# EasyEDA Pro project TTMT_ENTIRE_EASYEDA_PROJECT.epro, schematic panelschematic, sheets 2 to 3 of 3

## Sheets
2 P1_1: Create Date: 2026-05-14; Page Name: P1_1
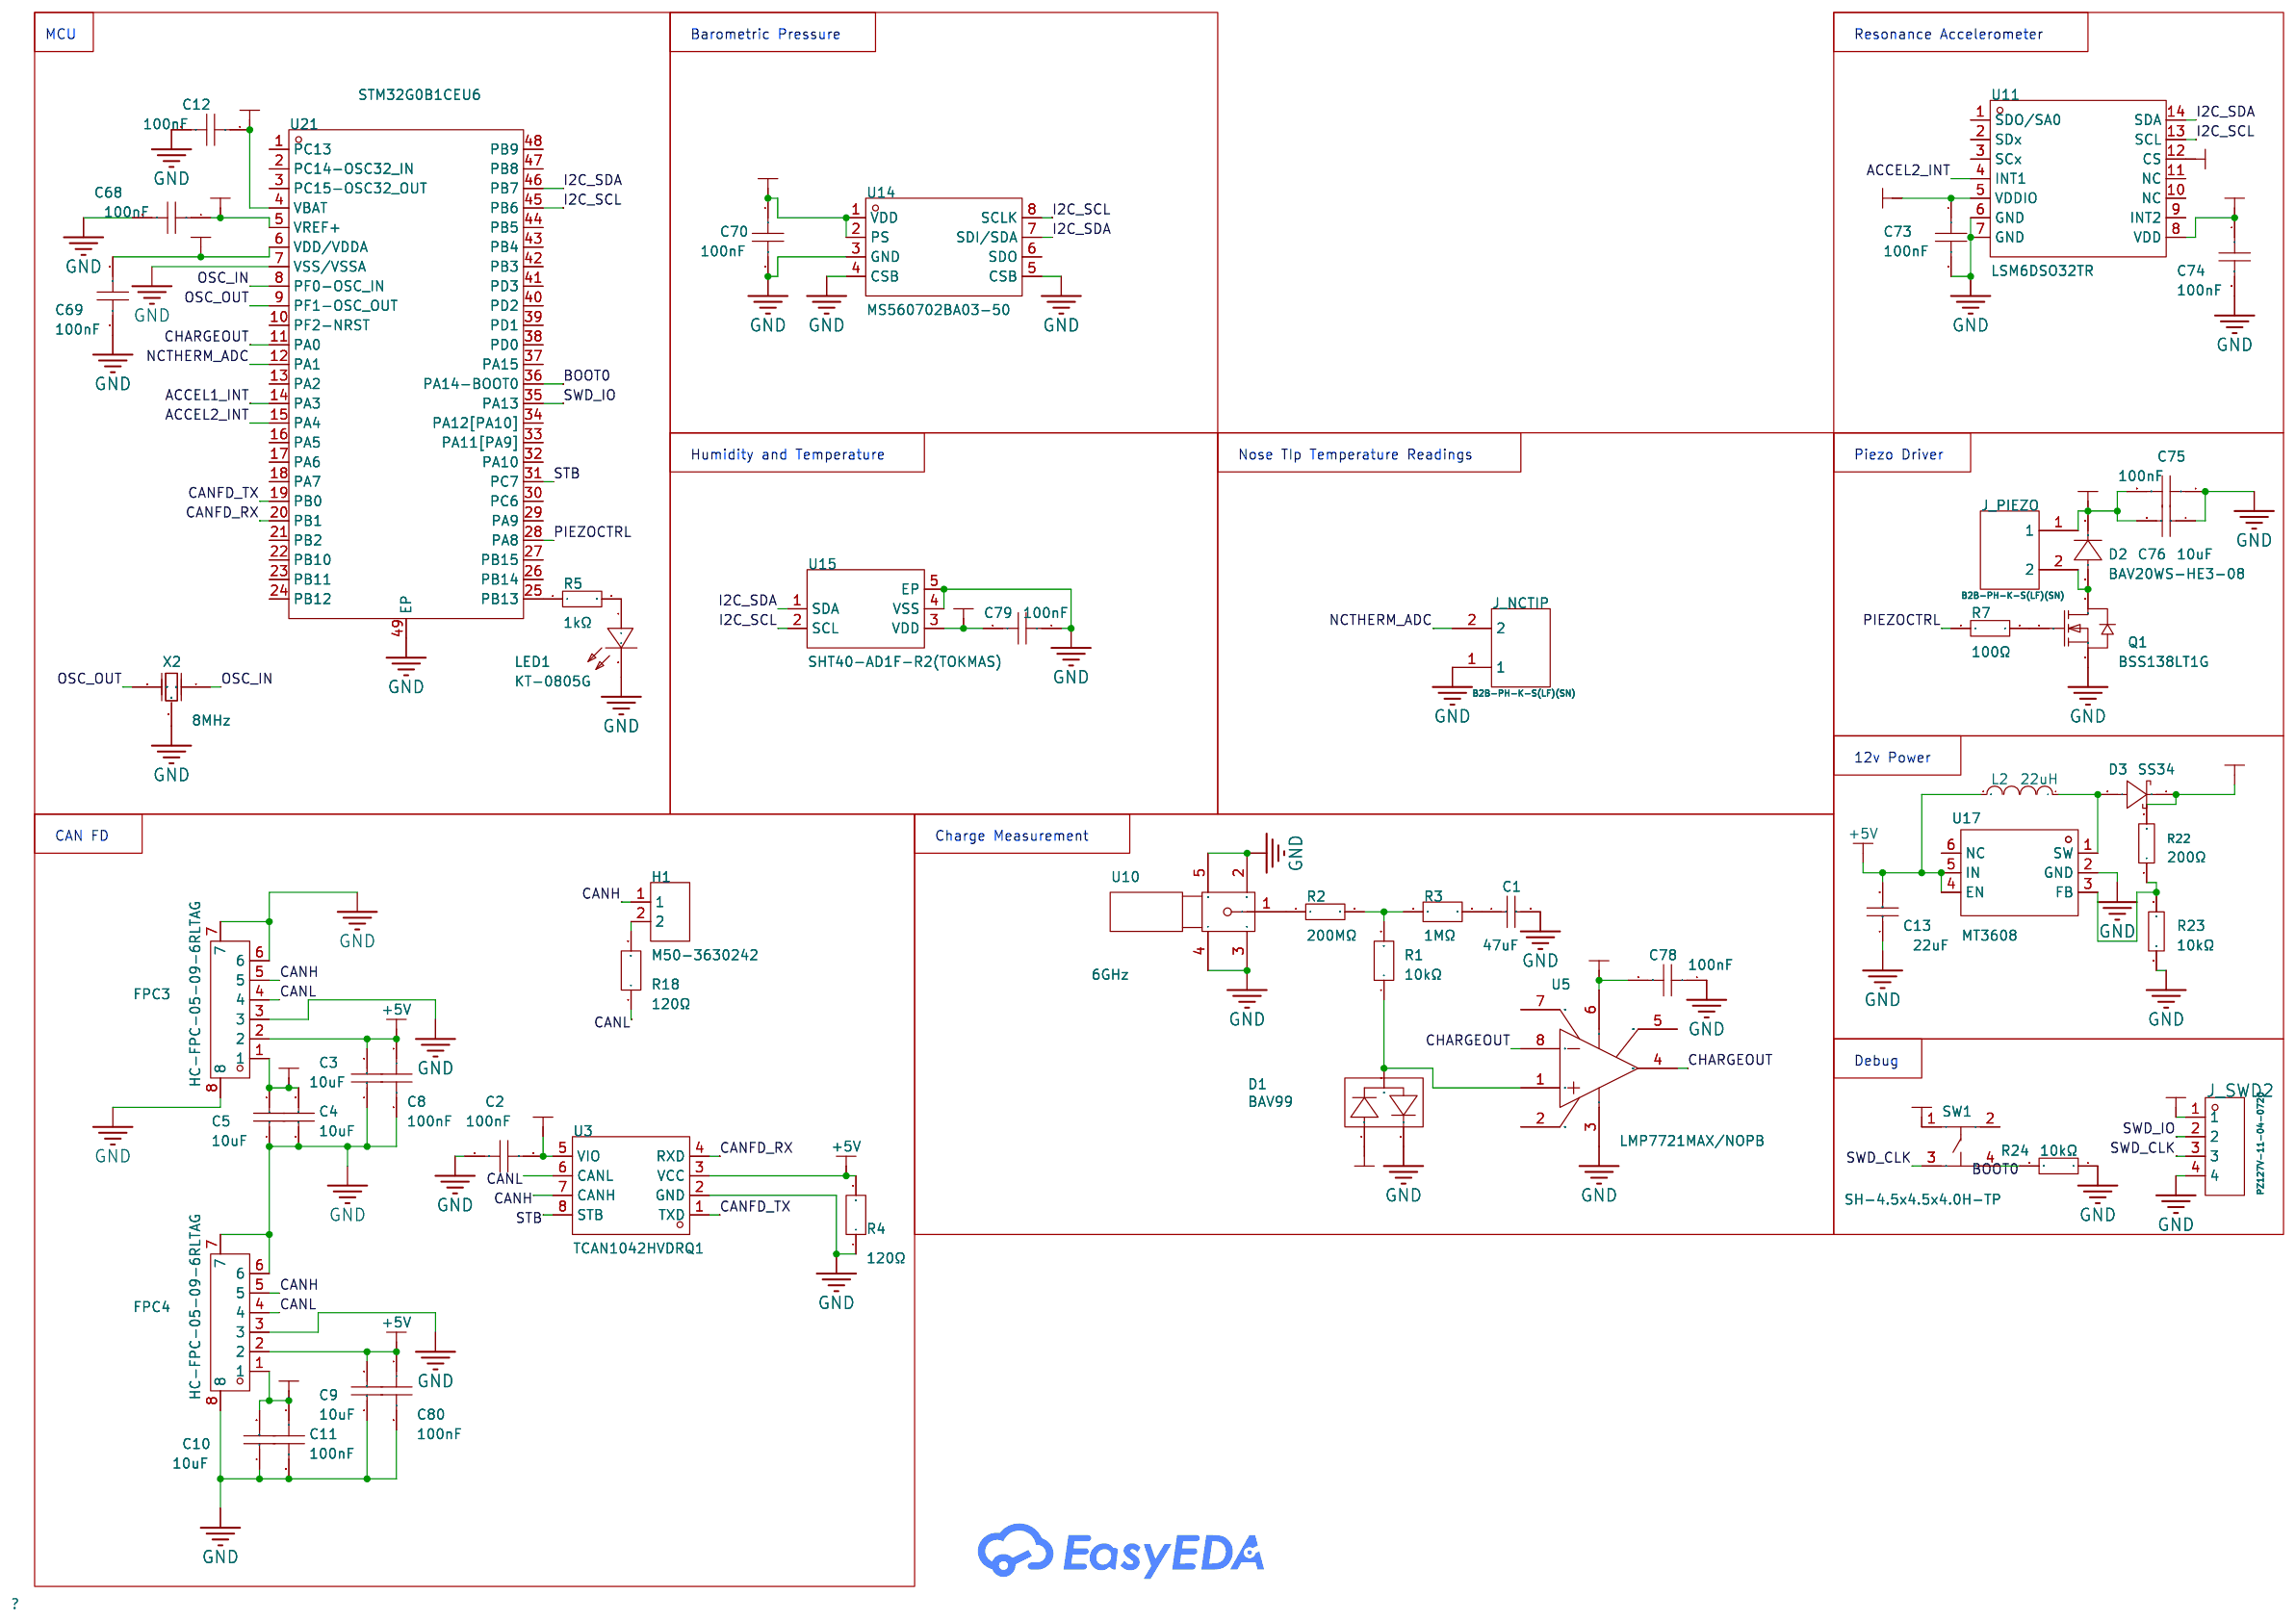
[diagram p6: P1_1]
3 P1_2: Create Date: 2026-05-14; Page Name: P1_2
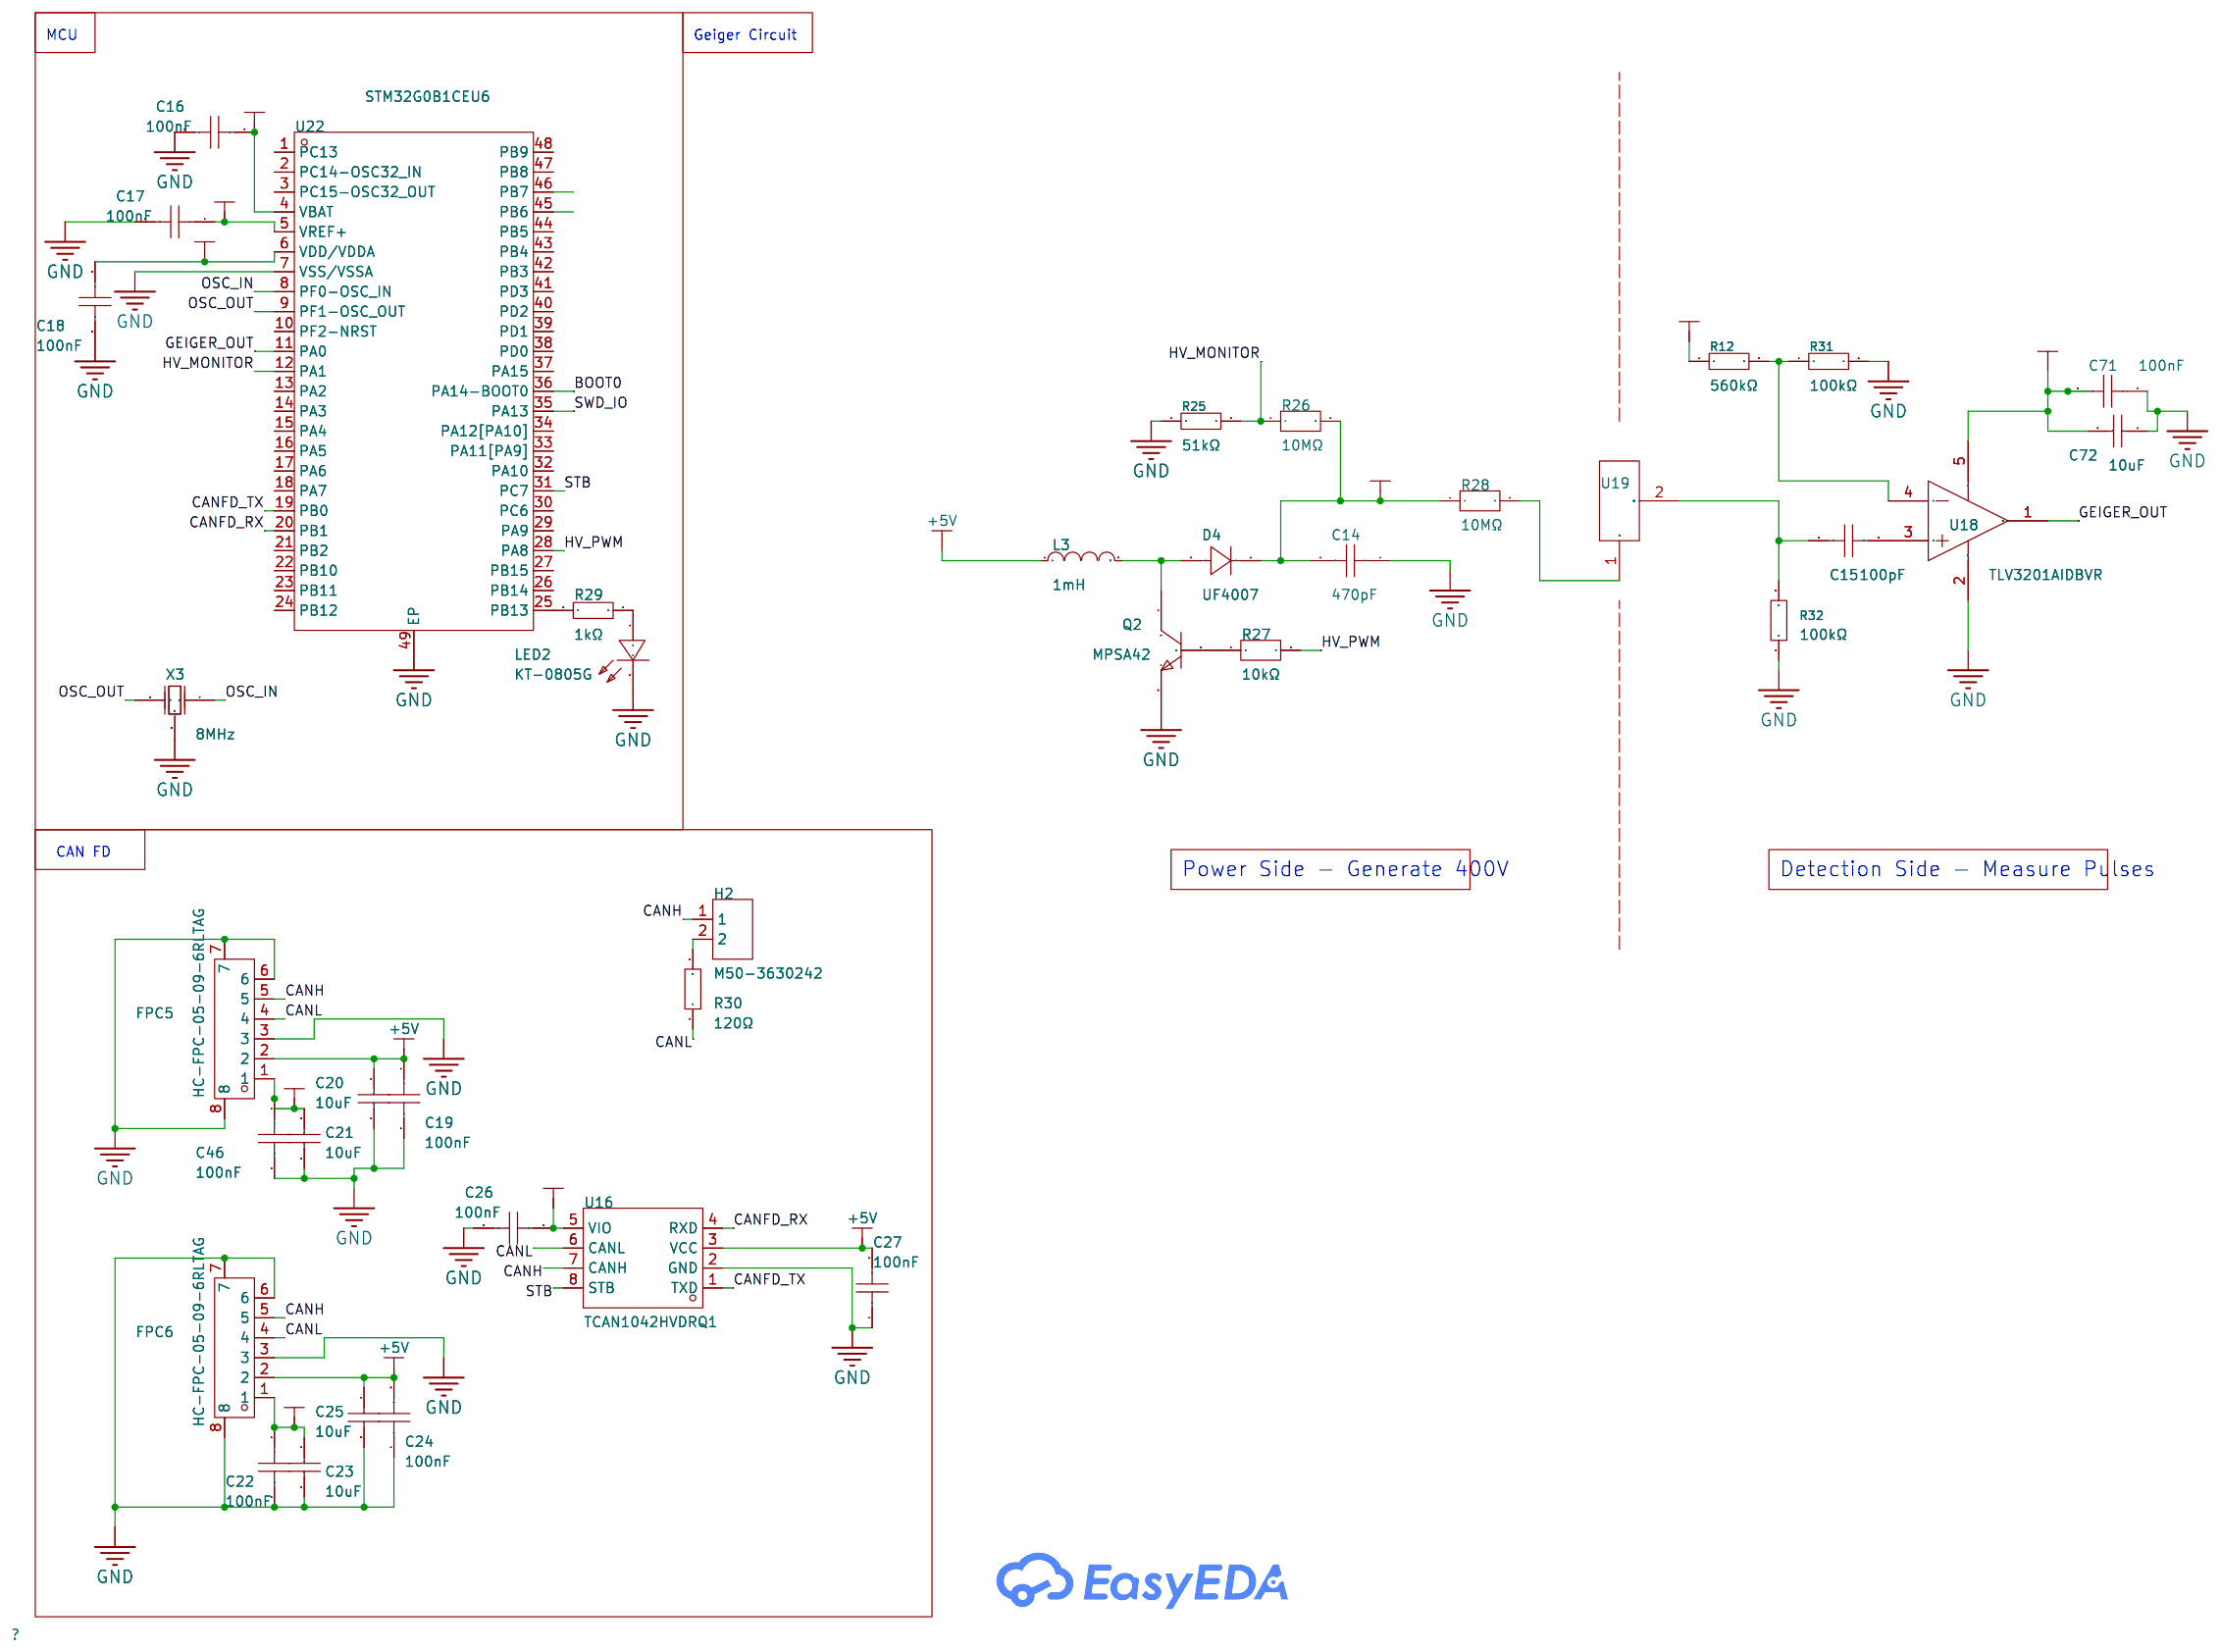
[diagram p7: P1_2]

## Parts
sheet P1_1
C1  47uF  [C0805]
C2  100nF  [C0402]
C3  10uF  [C0402]
C4  10uF  [C0402]
C5  10uF  [C0402]
C8  100nF  [C0402]
C9  10uF  [C0402]
C10  10uF  [C0402]
C11  100nF  [C0402]
C12  100nF  [C0402]
C13  22uF  [C1206]
C68  100nF  [C0402]
C69  100nF  [C0402]
C70  100nF  [C0402]
C73  100nF  [C0402]
C74  100nF  [C0402]
C75  100nF  [C0402]
C76  10uF  [C0402]
C78  100nF  [C0402]
C79  100nF  [C0402]
C80  100nF  [C0402]
D1  BAV99  [SOT-23-3_L2.9-W1.3-P1.90-LS2.4-BR]
D2  BAV20WS-HE3-08  [SOD-323_L1.8-W1.3-LS2.7-RD]
D3  SS34  [SMA_L4.2-W2.7-LS5.0-RD]
FPC3  HC-FPC-05-09-6RLTAG  [FPC-SMD_6P-P0.50_HC-FPC-05-09-6RLTAG]
FPC4  HC-FPC-05-09-6RLTAG  [FPC-SMD_6P-P0.50_HC-FPC-05-09-6RLTAG]
H1  M50-3630242  [HDR-SMD_2P-P1.27_M50-3630242]
J_NCTIP  B2B-PH-K-S(LF)(SN)  [CONN-TH_B2B-PH-K-S]
J_PIEZO  B2B-PH-K-S(LF)(SN)  [CONN-TH_B2B-PH-K-S]
J_SWD2  PZ127V-11-04-0720  [HDR-TH_4P-P1.27-V-M]
L2  22uH  [IND-SMD_L3.2-W2.5]
LED1  KT-0805G  [LED0805-R-RD]
Q1  BSS138LT1G  [SOT-23-3_L2.9-W1.6-P1.90-LS2.8-BR]
R1  10kΩ  [R0402]
R2  200MΩ  [RES-TH_L14.7-W2.54-P10.2-D0.8]
R3  1MΩ  [R0402]
R4  120Ω  [R0402]
R5  1kΩ  [R0402]
R7  100Ω  [R0402]
R18  120Ω  [R0402]
R22  200Ω  [R0603]
R23  10kΩ  [R0402]
R24  10kΩ  [R0402]
SW1  SH-4.5x4.5x4.0H-TP  [SW-SMD_4P-SH-4.5X4.5X4.0H-TP]
U3  TCAN1042HVDRQ1  [SOIC-8_L4.9-W3.9-P1.27-LS6.0-BL]
U5  LMP7721MAX/NOPB  [SOIC-8_L4.9-W3.9-P1.27-LS6.0-BL]
U10  6GHz  [MMCX-TH_DL-MMCX-KWE]
U11  LSM6DSO32TR  [LGA-14_L3.0-W2.5-P0.50-TL]
U14  MS560702BA03-50  [SENSOR-SMD_MS560702BA03-50]
U15  SHT40-AD1F-R2(TOKMAS)  [DFN-4_L1.5-W1.5-P0.80-TL-EP]
U17  MT3608  [SOT-23-6_L2.9-W1.6-P0.95-LS2.8-BL]
U21  STM32G0B1CEU6  [UFQFPN-48_L7.0-W7.0-P0.50-BL-EP]
X2  8MHz  [OSC-SMD_3P-L3.2-W1.3-P1.20-L]
sheet P1_2
C14  470pF  [C1111]
C15  100pF  [C1206]
C16  100nF  [C0402]
C17  100nF  [C0402]
C18  100nF  [C0402]
C19  100nF  [C0402]
C20  10uF  [C0402]
C21  10uF  [C0402]
C22  100nF  [C0402]
C23  10uF  [C0402]
C24  100nF  [C0402]
C25  10uF  [C0402]
C26  100nF  [C0402]
C27  100nF  [C0402]
C46  100nF  [C0402]
C71  100nF  [C0402]
C72  10uF  [C0402]
D4  UF4007  [DO-41_BD2.4-L4.7-P8.70-D0.9-RD]
FPC5  HC-FPC-05-09-6RLTAG  [FPC-SMD_6P-P0.50_HC-FPC-05-09-6RLTAG]
FPC6  HC-FPC-05-09-6RLTAG  [FPC-SMD_6P-P0.50_HC-FPC-05-09-6RLTAG]
H2  M50-3630242  [HDR-SMD_2P-P1.27_M50-3630242]
L3  1mH  [IND-SMD_L5.0-W5.0_FNR50XXS]
LED2  KT-0805G  [LED0805-R-RD]
Q2  MPSA42  [TO-92-3_L4.8-W3.7-P2.54-R]
R12  560kΩ  [R0402]
R25  51kΩ  [R0805]
R26  10MΩ  [R1206]
R27  10kΩ  [R0402]
R28  10MΩ  [R1206]
R29  1kΩ  [R0402]
R30  120Ω  [R0402]
R31  100kΩ  [R0402]
R32  100kΩ  [R0402]
U16  TCAN1042HVDRQ1  [SOIC-8_L4.9-W3.9-P1.27-LS6.0-BL]
U18  TLV3201AIDBVR  [SOT-23-5_L3.0-W1.7-P0.95-LS2.8-BR]
U19  SBM-21  [SBM21]  (no BOM)
U22  STM32G0B1CEU6  [UFQFPN-48_L7.0-W7.0-P0.50-BL-EP]
X3  8MHz  [OSC-SMD_3P-L3.2-W1.3-P1.20-L]

## Library data of the parts
C1 = CL21A476MQYNNNE: Capacitance:47uF Tolerance:±20% Tolerance:±20% Voltage Rating:6.3V Temperature Coefficient:X5R; LCSC Part Name: 47uF ±20% 6.3V; Supplier Part: C16780; Manufacturer: SAMSUNG(三星); Supplier Footprint: 0805; JLCPCB Part Class: Basic Part; Datasheet: https://item.szlcsc.com/datasheet/CL21A476MQYNNNE/17464.html; Supplier: LCSC; Tolerance: ±20%; Voltage Rating: 6.3V; Temperature Coefficient: X5R
C2 C8 C11 C12 C16-C19 C22 C24 C26 C27 C46 C68-C71 C73-C75 C78-C80 = CL05B104KO5NNNC: Capacitance:100nF Tolerance:±10% Tolerance:±10% Voltage Rating:16V Temperature Coefficient:X7R; LCSC Part Name: 100nF ±10% 16V; Supplier Part: C1525; Manufacturer: SAMSUNG(三星); Supplier Footprint: 0402; JLCPCB Part Class: Basic Part; Datasheet: https://item.szlcsc.com/datasheet/CL05B104KO5NNNC/1877.html; Supplier: LCSC; Tolerance: ±10%; Voltage Rating: 16V; Temperature Coefficient: X7R
C3-C5 C9 C10 C20 C21 C23 C25 C72 C76 = CL05A106MQ5NUNC: Capacitance:10uF Tolerance:±20% Tolerance:±20% Voltage Rating:6.3V Temperature Coefficient:X5R; LCSC Part Name: 10uF ±20% 6.3V; Supplier Part: C15525; Manufacturer: SAMSUNG(三星); Supplier Footprint: 0402; JLCPCB Part Class: Basic Part; Datasheet: https://item.szlcsc.com/datasheet/CL05A106MQ5NUNC/16204.html; Supplier: LCSC; Tolerance: ±20%; Voltage Rating: 6.3V; Temperature Coefficient: X5R
C13 = CL31A226KAHNNNE: Capacitance:22uF Tolerance:±10% Tolerance:±10% Voltage Rating:25V Temperature Coefficient:X5R; LCSC Part Name: 22uF ±10% 25V; Supplier Part: C12891; Manufacturer: SAMSUNG(三星); Supplier Footprint: 1206; JLCPCB Part Class: Basic Part; Datasheet: https://item.szlcsc.com/datasheet/CL31A226KAHNNNE/13537.html; Supplier: LCSC; Tolerance: ±10%; Voltage Rating: 25V; Temperature Coefficient: X5R
D1 = BAV99_C916421: Diode Configuration:1 Pair Series Connection Voltage - Forward(Vf@If):1.25V@150mA Voltage - DC Reverse(Vr):75V Current - Rectified:215mA Pd - Power Dissipation:350mW Reverse Leakage Current (Ir):1uA@75V Reverse Recovery Time (trr):4ns Operating Junction T; LCSC Part Name: 75V 215mA; Supplier Part: C916421; Manufacturer: JSMSEMI(杰盛微); Supplier Footprint: SOT-23; JLCPCB Part Class: Extended Part; Datasheet: https://item.szlcsc.com/datasheet/BAV99/990917.html; Supplier: LCSC; Diode Configuration: 1 Pair Series Connection; Voltage - Forward(Vf@If): 1.25V@150mA; Voltage - DC Reverse(Vr): 75V; Current - Rectified: 215mA; Pd - Power Dissipation: 350mW; Reverse Leakage Current (Ir): 1uA@75V; Reverse Recovery Time (trr): 4ns; Operating Junction Temperature Range: -65℃~+150℃; Non-Repetitive Peak Forward Surge Current: 2A
D2 = BAV20WS-HE3-08: Diode Configuration:1 Independent Pd - Power Dissipation:200mW Current - Rectified:250mA Voltage - DC Reverse(Vr):150V Voltage - Forward(Vf@If):1.25V@200mA Non-Repetitive Peak Forward Surge Current:1A Reverse Leakage Current (Ir):100nA@150V Reverse Recove; LCSC Part Name: 150V 250mA; Supplier Part: C3151637; Manufacturer: VISHAY(威世); Supplier Footprint: SOD-323; JLCPCB Part Class: Extended Part; Datasheet: https://item.szlcsc.com/datasheet/BAV20WS-HE3-08/3712173.html; Supplier: LCSC; Diode Configuration: 1 Independent; Pd - Power Dissipation: 200mW; Current - Rectified: 250mA; Voltage - DC Reverse(Vr): 150V; Voltage - Forward(Vf@If): 1.25V@200mA; Non-Repetitive Peak Forward Surge Current: 1A; Reverse Leakage Current (Ir): 100nA@150V; Reverse Recovery Time (trr): 50ns; Operating Junction Temperature Range: -55℃~+150℃
D3 = SS34_C2837271: Diode Configuration:- Voltage - Forward(Vf@If):550mV@3A Voltage - DC Reverse(Vr):40V Current - Rectified:3A Reverse Leakage Current (Ir):-; LCSC Part Name: 电压:40V 电流:3A; Supplier Part: C2837271; Manufacturer: JSMSEMI(杰盛微); Supplier Footprint: SMA(DO-214AC); JLCPCB Part Class: Extended Part; Datasheet: https://item.szlcsc.com/datasheet/SS34/3007843.html; Supplier: LCSC; Voltage - Forward(Vf@If): 550mV@3A; Voltage - DC Reverse(Vr): 40V; Current - Rectified: 3A
FPC3-FPC6 = HC-FPC-05-09-6RLTAG: Locking Feature:Hinged Lid Contact Type:Double-Sided Contacts, Top and Bottom Entry Number of Contacts:6P Pitch:0.5mm Mounting Type:Surface Mount, Right Angle FFC, FCB Thickness:0.3mm FFC, FCB Thickness:0.3mm Height Above Board:1mm Contact Material:Copper; LCSC Part Name: 翻盖式 双侧触点/上下接 P数:6P 间距:0.5mm; Supplier Part: C5213748; Manufacturer: HCTL(华灿天禄); Supplier Footprint: SMD,P=0.5mm,卧贴; JLCPCB Part Class: Extended Part; Datasheet: https://item.szlcsc.com/datasheet/HC-FPC-05-09-6RLTAG/5909040.html; Supplier: LCSC; Locking Feature: Hinged Lid; Contact Type: Double-Sided Contacts, Top and Bottom Entry; Number of Contacts: 6P; Pitch: 0.5mm; Mounting Type: Surface Mount, Right Angle; FFC, FCB Thickness: 0.3mm; Height Above Board: 1mm; Contact Material: Copper Alloy; Operating Temperature: -55℃~+85℃
H1 H2 = M50-3630242: Pitch:1.27mm Row Spacing:- Circluar Pins/Square Pins:Pin Header Mounting Type:Surface Mount,Vertical Number of Rows:1 Number of Pins:2P Current Rating:1A Length of Mating Pin:3mm Insulation Height:1mm Length of End Connection Pin:- Contact Material:Brass; LCSC Part Name: 间距:1.27mm 方针 立贴; Supplier Part: C7297891; Manufacturer: Harwin; Supplier Footprint: SMD,P=1.27mm; JLCPCB Part Class: Extended Part; Datasheet: https://item.szlcsc.com/datasheet/M50-3630242/8267898.html; Supplier: LCSC; Pitch: 1.27mm; Circluar Pins/Square Pins: Pin Header; Mounting Type: Surface Mount,Vertical; Number of Rows: 1; Number of Pins: 2P; Current Rating: 1A; Length of Mating Pin: 3mm; Insulation Height: 1mm; Contact Material: Brass; Contact Plating: Tin; Operating Temperature: -40℃~+105℃; Color: Black
J_NCTIP J_PIEZO = B2B-PH-K-S(LF)(SN): Pins Structure:1x2P Pitch:2mm Mounting Type:Through Hole Reference Series:PH Number of Pins:2P Number of Rows:1 Number of PINs Per Row:2 Row Spacing:- Current Rating:2A Contact Material:Brass Contact Plating:Tin Operating Temperature:-25℃~+85℃ Operating T; LCSC Part Name: 1x2P 间距:2mm 直插 系列:PH; Supplier Part: C131337; Manufacturer: JST; Supplier Footprint: 插件,P=2mm; JLCPCB Part Class: Extended Part; Datasheet: https://item.szlcsc.com/datasheet/B2B-PH-K-S(LF)(SN)/142630.html; Supplier: LCSC; Pins Structure: 1x2P; Pitch: 2mm; Mounting Type: Through Hole; Reference Series: PH; Number of Pins: 2P; Number of Rows: 1; Number of PINs Per Row: 2; Current Rating: 2A; Contact Material: Brass; Contact Plating: Tin; Operating Temperature: -25℃~+85℃; Voltage Rating: 100V; Plastic Material: PA66; Flame Retardant Rating: UL94V-0; Supplementary Features: K Pin; Color: White; Z-Height of the Board: 6mm; X-Length of Bottom Edge on Board (Spacing Line): 5.9mm; Y-Width of Bottom Edge on Board: 4.5mm
J_SWD2 = PZ127V-11-04-0720: Pin Structure:1x4P Pitch:1.27mm Row Spacing:- Circluar Pins/Square Pins:Pin Header Mounting Type:Through Hole Number of Rows:1 Number of Pins:4P Current Rating:1A Voltage Rating (Max):- Length of Mating Pin:3.9mm Insulation Height:1mm Length of End Connec; LCSC Part Name: 1x4P 间距:1.27mm 方针 直插; Supplier Part: C541879; Manufacturer: XFCN(兴飞); Supplier Footprint: 插件,P=1.27mm; JLCPCB Part Class: Extended Part; Datasheet: https://item.szlcsc.com/datasheet/PZ127V-11-04-0720/562500.html; Supplier: LCSC; Pin Structure: 1x4P; Pitch: 1.27mm; Circluar Pins/Square Pins: Pin Header; Mounting Type: Through Hole; Number of Rows: 1; Number of Pins: 4P; Current Rating: 1A; Length of Mating Pin: 3.9mm; Insulation Height: 1mm; Length of End Connection Pin: 2.3mm; Contact Material: Brass; Operating Temperature: -40℃~+105℃; Color: Black
L2 = NLV32T-220J-EF: Inductance: Tolerance:±5% Tolerance:±5% Rated Current: Saturation Current (Isat):- DC Resistance (DCR): Ratings:-; LCSC Part Name: 22uH ±5%; Supplier Part: C295143; Manufacturer: TDK; Supplier Footprint: 1210; JLCPCB Part Class: Extended Part; Datasheet: https://atta.szlcsc.com/upload/public/pdf/source/20190114/C295361_7F4084769062E2B02C18E7F2085EC2BC.pdf; Supplier: LCSC; Tolerance: ±5%
LED1 LED2 = KT-0805G: Lamp Holder Type:- Illumination Color:Emerald Green Voltage - Forward(Vf):2.6V~3.1V Voltage - Forward(Vf):2.6V~3.1V Power(Watts):100mW Forward Current:5mA Wavelength - Dominant:513nm~528nm Wavelength - Dominant:513nm~528nm Peak Wavelength:525nm Diode Conf; LCSC Part Name: 0805 翠绿 高亮; Supplier Part: C2297; Manufacturer: KENTO; Supplier Footprint: 0805; JLCPCB Part Class: Basic Part; Datasheet: https://item.szlcsc.com/datasheet/KT-0805G/2670.html; Supplier: LCSC; Illumination Color: Emerald Green; Voltage - Forward(Vf): 2.6V~3.1V; Power(Watts): 100mW; Forward Current: 5mA; Wavelength - Dominant: 513nm~528nm; Peak Wavelength: 525nm; Diode Configuration: Discrete Diode; Lens Color: Water Clear; Luminous Intensity: 430mcd; Viewing Angle: 120°; Operating Temperature: -40℃~+85℃
Q1 = BSS138LT1G: Number:1 N-Channel Drain to Source Voltage:50V Current - Continuous Drain(Id):200mA RDS(on):5.6Ω@2.75V Pd - Power Dissipation:225mW Gate Threshold Voltage (Vgs(th)):500mV Input Capacitance(Ciss):50pF@25V Reverse Transfer Capacitance (Crss@Vds):5pF@25V Ope; LCSC Part Name: 1个N沟道 耐压:50V 电流:200mA; Supplier Part: C82045; Manufacturer: onsemi(安森美); Supplier Footprint: SOT-23; JLCPCB Part Class: Extended Part; Datasheet: https://item.szlcsc.com/datasheet/BSS138LT1G/83200.html; Supplier: LCSC; Number: 1 N-Channel; Drain to Source Voltage: 50V; Current - Continuous Drain(Id): 200mA; RDS(on): 5.6Ω@2.75V; Pd - Power Dissipation: 225mW; Gate Threshold Voltage (Vgs(th)): 500mV; Input Capacitance(Ciss): 50pF@25V; Reverse Transfer Capacitance (Crss@Vds): 5pF@25V; Operating Temperature: -55℃~+150℃
R1 = FRC0402F1002TS: Type:Thick Film Resistor Resistance:10kΩ Tolerance:±1% Tolerance:±1% Power(Watts):62.5mW Voltage-Supply(Max):50V Temperature Coefficient:±100ppm/℃ Temperature Coefficient:±100ppm/℃ Operating Temperature:-55℃~+155℃ Operating Temperature:-55℃~+155℃; LCSC Part Name: 10kΩ ±1% 62.5mW 厚膜电阻; Supplier Part: C2906861; Manufacturer: FOJAN(富捷); Supplier Footprint: 0402; JLCPCB Part Class: Extended Part; Supplier: LCSC; Type: Thick Film Resistor; Tolerance: ±1%; Power(Watts): 62.5mW; Voltage-Supply(Max): 50V; Temperature Coefficient: ±100ppm/℃; Operating Temperature: -55℃~+155℃
R2 = SM102032006FE: Type:Thick Film Resistor Resistance: Tolerance:±1% Tolerance:±1% Power(Watts):1W Temperature Coefficient:±50ppm/℃ Temperature Coefficient:±50ppm/℃ Operating Temperature:-55℃~+110℃ Operating Temperature:-55℃~+110℃; LCSC Part Name: 厚膜电阻 200MΩ ±1% 1W; Supplier Part: C2641611; Manufacturer: Ohmite; Supplier Footprint: 插件; JLCPCB Part Class: Extended Part; Datasheet: https://item.szlcsc.com/datasheet/SM102032006FE/2733517.html; Supplier: LCSC; Type: Thick Film Resistor; Tolerance: ±1%; Power(Watts): 1W; Temperature Coefficient: ±50ppm/℃; Operating Temperature: -55℃~+110℃
R3 = FRC0402F1004TS: Type:Thick Film Resistor Resistance:1MΩ Tolerance:±1% Tolerance:±1% Power(Watts):62.5mW Voltage-Supply(Max):50V Temperature Coefficient:±100ppm/℃ Temperature Coefficient:±100ppm/℃ Operating Temperature:-55℃~+155℃ Operating Temperature:-55℃~+155℃; LCSC Part Name: 1MΩ ±1% 62.5mW 厚膜电阻; Supplier Part: C2909328; Manufacturer: FOJAN(富捷); Supplier Footprint: 0402; JLCPCB Part Class: Extended Part; Supplier: LCSC; Type: Thick Film Resistor; Tolerance: ±1%; Power(Watts): 62.5mW; Voltage-Supply(Max): 50V; Temperature Coefficient: ±100ppm/℃; Operating Temperature: -55℃~+155℃
R4 R18 = FRC0402F1200TS: Type:Thick Film Resistor Resistance:120Ω Tolerance:±1% Tolerance:±1% Power(Watts):62.5mW Voltage-Supply(Max):50V Temperature Coefficient:±100ppm/℃ Temperature Coefficient:±100ppm/℃ Operating Temperature:-55℃~+155℃ Operating Temperature:-55℃~+155℃; LCSC Part Name: 120Ω ±1% 62.5mW 厚膜电阻; Supplier Part: C2909315; Manufacturer: FOJAN(富捷); Supplier Footprint: 0402; JLCPCB Part Class: Extended Part; Datasheet: https://item.szlcsc.com/datasheet/FRC0402F1200TS/3186250.html; Supplier: LCSC; Type: Thick Film Resistor; Tolerance: ±1%; Power(Watts): 62.5mW; Voltage-Supply(Max): 50V; Temperature Coefficient: ±100ppm/℃; Operating Temperature: -55℃~+155℃
R5 R29 = 0402WGF1001TCE: Type:Thick Film Resistor Resistance:1kΩ Tolerance:±1% Tolerance:±1% Power(Watts):62.5mW Voltage-Supply(Max):50V Temperature Coefficient:±100ppm/℃ Temperature Coefficient:±100ppm/℃ Operating Temperature:-55℃~+155℃ Operating Temperature:-55℃~+155℃; LCSC Part Name: 1kΩ ±1% 62.5mW 厚膜电阻; Supplier Part: C11702; Manufacturer: UNI-ROYAL(厚声); Supplier Footprint: 0402; JLCPCB Part Class: Basic Part; Datasheet: https://item.szlcsc.com/datasheet/0402WGF1001TCE/12256.html; Supplier: LCSC; Type: Thick Film Resistor; Tolerance: ±1%; Power(Watts): 62.5mW; Voltage-Supply(Max): 50V; Temperature Coefficient: ±100ppm/℃; Operating Temperature: -55℃~+155℃
R7 = 0402WGF1000TCE: Type:Thick Film Resistors Resistance: Tolerance:±1% Tolerance:±1% Power(Watts): Overload Voltage (Max): Temperature Coefficient:±200ppm/℃ Temperature Coefficient:±200ppm/℃ Operating Temperature Range:-55℃~+155℃ Operating Temperature Range:-55℃~+155℃; LCSC Part Name: 100Ω ±1% 62.5mW 厚膜电阻; Supplier Part: C25076; Manufacturer: UNI-ROYAL(厚声); Supplier Footprint: 0402; JLCPCB Part Class: Basic Part; Datasheet: https://atta.szlcsc.com/upload/public/pdf/source/20200306/C422600_1E6D84923E4A46A82E41ADD87F860B5C.pdf; Supplier: LCSC; Type: Thick Film Resistors; Tolerance: ±1%; Temperature Coefficient: ±200ppm/℃; Operating Temperature Range: -55℃~+155℃
R22 = 0603WAF2000T5E: Type:Thick Film Resistor Resistance:200Ω Tolerance:±1% Tolerance:±1% Power(Watts):100mW Voltage-Supply(Max):75V Temperature Coefficient:±100ppm/℃ Temperature Coefficient:±100ppm/℃ Operating Temperature:-55℃~+155℃ Operating Temperature:-55℃~+155℃; LCSC Part Name: 200Ω ±1% 100mW 厚膜电阻; Supplier Part: C8218; Manufacturer: UNI-ROYAL(厚声); Supplier Footprint: 0603; JLCPCB Part Class: Basic Part; Datasheet: https://item.szlcsc.com/datasheet/0603WAF2000T5E/8708.html; Supplier: LCSC; Type: Thick Film Resistor; Tolerance: ±1%; Power(Watts): 100mW; Voltage-Supply(Max): 75V; Temperature Coefficient: ±100ppm/℃; Operating Temperature: -55℃~+155℃
R23 R24 = 0402WGF1002TCE: Type:Thick Film Resistor Resistance:10kΩ Tolerance:±1% Tolerance:±1% Power(Watts):62.5mW Voltage-Supply(Max):50V Temperature Coefficient:±100ppm/℃ Temperature Coefficient:±100ppm/℃ Operating Temperature:-55℃~+155℃ Operating Temperature:-55℃~+155℃; LCSC Part Name: 10kΩ ±1% 62.5mW 厚膜电阻; Supplier Part: C25744; Manufacturer: UNI-ROYAL(厚声); Supplier Footprint: 0402; JLCPCB Part Class: Basic Part; Datasheet: https://item.szlcsc.com/datasheet/0402WGF1002TCE/26487.html; Supplier: LCSC; Type: Thick Film Resistor; Tolerance: ±1%; Power(Watts): 62.5mW; Voltage-Supply(Max): 50V; Temperature Coefficient: ±100ppm/℃; Operating Temperature: -55℃~+155℃
SW1 = SH-4.5x4.5x4.0H-TP: LCSC Part Name: TS4540TP 250gf编带; Supplier Part: C52092029; Manufacturer: SHOU HAN(首韩); Supplier Footprint: SMD; JLCPCB Part Class: Extended Part; Datasheet: https://item.szlcsc.com/datasheet/SH-4.5x4.5x4.0H-TP/54864053.html; Supplier: LCSC
U3 U16 = TCAN1042HVDRQ1: Type:CAN FD Transceiver Data Rate:2Mbps Voltage - Supply:4.5V~5.5V Voltage - Supply:4.5V~5.5V Current - Supply:80mA Operating Temperature:-55℃~+125℃ Operating Temperature:-55℃~+125℃ Number of Channels:- Quiescent Supply Current:22uA; LCSC Part Name: TCAN1042-Q1 汽车故障保护 CAN 收发器，带 CAN FD; Supplier Part: C485807; Manufacturer: TI(德州仪器); Supplier Footprint: SOIC-8; JLCPCB Part Class: Extended Part; Datasheet: https://www.ti.com/cn/lit/gpn/tcan1042hv-q1; Supplier: LCSC; Type: CAN FD Transceiver; Data Rate: 2Mbps; Voltage - Supply: 4.5V~5.5V; Current - Supply: 80mA; Operating Temperature: -55℃~+125℃; Quiescent Supply Current: 22uA
U5 = LMP7721MAX/NOPB: Number of Channels:1 Maximum Power Supply Range (Vdd-Vss):5.5V Rail to Rail:Rail-to-Rail Output Gain Bandwidth Product:17MHz Vos - Input Offset Voltage:26uV Input Offset Voltage Drift(Vos TC):1.5uV/℃ Slew Rate:12.76V/us Ib - Input Bias Current:0.003pA Inp; LCSC Part Name: 超低输入偏置电流精密放大器; Supplier Part: C2864387; Manufacturer: TI(德州仪器); Supplier Footprint: SOIC-8; JLCPCB Part Class: Extended Part; Datasheet: https://www.ti.com/cn/lit/gpn/lmp7721; Supplier: LCSC; Number of Channels: 1; Maximum Power Supply Range (Vdd-Vss): 5.5V; Rail to Rail: Rail-to-Rail Output; Gain Bandwidth Product: 17MHz; Vos - Input Offset Voltage: 26uV; Input Offset Voltage Drift(Vos TC): 1.5uV/℃; Slew Rate: 12.76V/us; Ib - Input Bias Current: 0.003pA; Input Offset Current(Ios): 0.006pA; Input Voltage Noise Density: 6.5nV/√Hz@1kHz; Common Mode Rejection Ratio(CMRR): 100dB; Quiescent Current: 1.3mA; Output Current: 46mA; Operating Temperature: -40℃~+125℃; Single supply: 1.8V~5.5V
U10 = BWMMCX-KWE: Connector Type:Board Side Interface:Inner Bore Number of Ports:1 Interface Diameter:3.45mm Interface Length/Height:6.8mm Frequency:6GHz RF Series:- Impedance:50Ω Style:Elbow Operating Temperature Range:- Operating Temperature Range:-; LCSC Part Name: 内孔 弯头; Supplier Part: C5137199; Manufacturer: BAT WIRELESS(蝙蝠无线); Supplier Footprint: 插件; JLCPCB Part Class: Extended Part; Datasheet: https://item.szlcsc.com/datasheet/BWMMCX-KWE/5745896.html; Supplier: LCSC; Connector Type: Board Side; Interface: Inner Bore; Number of Ports: 1; Interface Diameter: 3.45mm; Interface Length/Height: 6.8mm; Impedance: 50Ω; Style: Elbow
U11 = LSM6DSO32TR: Sensor Type:加速度计陀螺仪 Operating Temperature:-40℃~+85℃ Operating Temperature:-40℃~+85℃; Supplier Part: C1864162; Manufacturer: ST(意法半导体); Supplier Footprint: LGA-14(2.5x3); JLCPCB Part Class: Extended Part; Datasheet: https://atta.szlcsc.com/upload/public/pdf/source/20210701/34CD2F0BBC0E28C2A99EB6D9CC8DCB24.pdf; Supplier: LCSC; Sensor Type: 加速度计陀螺仪; Operating Temperature: -40℃~+85℃
U14 = MS560702BA03-50: Pressure range:1Kpa~1.2bar Pressure range:1Kpa~1.2bar Voltage - Supply:1.8V~3.6V Voltage - Supply:1.8V~3.6V Standby Current:140nA Interface:SPI；I2C Module:Yes Absolute Accuracy:1.5mbar Relative Accuracy:- Features:片内温度输出；集成ADC与数字接口；片内校准与非易失存储 Temperature; LCSC Part Name: MS5607-02BA03; Supplier Part: C97627; Manufacturer: TE Connectivity(泰科电子); Supplier Footprint: SMD-8P; JLCPCB Part Class: Extended Part; Datasheet: https://item.szlcsc.com/datasheet/MS560702BA03-50/98835.html; Supplier: LCSC; Pressure range: 1Kpa~1.2bar; Voltage - Supply: 1.8V~3.6V; Standby Current: 140nA; Interface: SPI；I2C; Module: Yes; Absolute Accuracy: 1.5mbar; Features: 片内温度输出；集成ADC与数字接口；片内校准与非易失存储; Operating Temperature: -40℃~+85℃
U15 = SHT40-AD1F-R2(TOKMAS): Supplier Part: C54823945; Manufacturer: Tokmas(托克马斯); Supplier Footprint: DFN-4(1.5x1.5); JLCPCB Part Class: Extended Part; Datasheet: https://item.szlcsc.com/datasheet/SHT40-AD1F-R2(TOKMAS)/58293138.html; Supplier: LCSC
U17 = MT3608: Function:Boost Output Type:Adjustable Voltage - Supply:2V~24V Voltage - Supply:2V~24V Output Voltage:- Output Voltage:- Output Current:2A Frequency - Switching:1.2MHz Frequency - Switching:1.2MHz Operating Temperature:-40℃~+85℃ Operating Temperature:-40℃~; LCSC Part Name: 老版本 高效1.2MHz 2A升压转换器; Supplier Part: C84817; Manufacturer: 西安航天民芯; Supplier Footprint: SOT-23-6; JLCPCB Part Class: Extended Part; Datasheet: https://item.szlcsc.com/datasheet/MT3608/85988.html; Supplier: LCSC; Function: Boost; Output Type: Adjustable; Voltage - Supply: 2V~24V; Output Current: 2A; Frequency - Switching: 1.2MHz; Operating Temperature: -40℃~+85℃; Synchronous Rectifier: No; Number of Outputs: 1; Topology: Boost; Quiescent Current: 100uA；1.6mA; Switch tube (built-in/external): Built-in
U21 U22 = STM32G0B1CEU6: LCSC Part Name: 主流Arm Cortex-M0+ 32位MCU，最高512KB闪存，144KB内存，6个USART，定时器，ADC，DAC，通信接口，1.7-3.6V; Supplier Part: C2829190; Manufacturer: ST(意法半导体); Supplier Footprint: UFQFPN-48(7x7); JLCPCB Part Class: Extended Part; Datasheet: https://item.szlcsc.com/datasheet/STM32G0B1CEU6/2979251.html; Supplier: LCSC
X2 X3 = CSTNE8M00GH5C000R0: Frequency:8MHz Built - in Load Capacitance:33pF Resonant Impedance:40Ω Operating Temperature:-40℃~+125℃ Operating Temperature:-40℃~+125℃; LCSC Part Name: 8MHz ±0.07% 内置负载电容:33pF; Supplier Part: C341525; Manufacturer: muRata(村田); Supplier Footprint: SMD3213-3P; JLCPCB Part Class: Extended Part; Datasheet: https://item.szlcsc.com/datasheet/CSTNE8M00GH5C000R0/318917.html; Supplier: LCSC; Built - in Load Capacitance: 33pF; Resonant Impedance: 40Ω; Operating Temperature: -40℃~+125℃
C14 = VJ1111D471KXLAT: Capacitance:470pF Tolerance:±10% Tolerance:±10% Voltage Rating:630V Temperature Coefficient:C0G; LCSC Part Name: 470pF ±10% 630V; Supplier Part: C2314698; Manufacturer: VISHAY(威世); Supplier Footprint: 1111; JLCPCB Part Class: Extended Part; Datasheet: https://item.szlcsc.com/datasheet/VJ1111D471KXLAT/2406794.html; Supplier: LCSC; Tolerance: ±10%; Voltage Rating: 630V; Temperature Coefficient: C0G
C15 = 1206N101J631CT: Capacitance: Tolerance:±5% Tolerance:±5% Voltage Rated: Temperature Coefficient:; LCSC Part Name: 100pF ±5% 630V; Supplier Part: C3866841; Manufacturer: Walsin(华新科); Supplier Footprint: 1206; JLCPCB Part Class: Extended Part; Datasheet: https://atta.szlcsc.com/upload/public/pdf/source/20230922/C914574D0A74BEF9995333FF99F7B45C.pdf; Supplier: LCSC; Tolerance: ±5%
D4 = UF4007_C960666: Diode Configuration:- Voltage - Forward(Vf@If):1.7V@1A Voltage - DC Reverse(Vr):1kV Current - Rectified:1A Reverse Leakage Current (Ir):5uA@1kV Reverse Recovery Time (trr):75ns Operating Junction Temperature Range:-50℃~+150℃ Operating Junction Temperature; LCSC Part Name: 耐压:1kV 电流:1A 反向恢复时间：75ns; Supplier Part: C960666; Manufacturer: MDD(辰达半导体); Supplier Footprint: DO-41; JLCPCB Part Class: Extended Part; Datasheet: https://item.szlcsc.com/datasheet/UF4007/1039942.html; Supplier: LCSC; Voltage - Forward(Vf@If): 1.7V@1A; Voltage - DC Reverse(Vr): 1kV; Current - Rectified: 1A; Reverse Leakage Current (Ir): 5uA@1kV; Reverse Recovery Time (trr): 75ns; Operating Junction Temperature Range: -50℃~+150℃; Non-Repetitive Peak Forward Surge Current: 30A
L3 = FNR5040S102MT: Inductance:1000uH Tolerance:±20% Tolerance:±20% Current Rating:230mA Current - Saturation(Isat):250mA DC Resistance(DCR):7.8Ω Type:Magnetic Core Shielded Winding Alloy Inductor; LCSC Part Name: 1mH ±20% 250mA; Supplier Part: C167987; Manufacturer: cjiang(长江微电); Supplier Footprint: SMD,5x5mm; JLCPCB Part Class: Extended Part; Datasheet: https://atta.szlcsc.com/upload/public/pdf/source/20190327/C167925_9EFF0AABC4CA629C2CC95961DBF7D39D.pdf; Supplier: LCSC; Tolerance: ±20%; Current Rating: 230mA; Current - Saturation(Isat): 250mA; DC Resistance(DCR): 7.8Ω; Type: Magnetic Core Shielded Winding Alloy Inductor
Q2 = MPSA42_C305411: type:NPN Current - Collector(Ic):500mA Collector - Emitter Voltage VCEO:300V Pd - Power Dissipation:1.5W DC Current Gain:40@10mA,10V DC Current Gain:40@10mA,10V Transition frequency(fT):50MHz Current - Collector Cutoff:100nA Vce Saturation(VCE(sat)):500mV; LCSC Part Name: TO-92塑封封装NPN半导体三极管; Supplier Part: C305411; Manufacturer: BLUE ROCKET(蓝箭); Supplier Footprint: TO-92; JLCPCB Part Class: Extended Part; Datasheet: https://item.szlcsc.com/datasheet/MPSA42/289740.html; Supplier: LCSC; type: NPN; Current - Collector(Ic): 500mA; Collector - Emitter Voltage VCEO: 300V; Pd - Power Dissipation: 1.5W; DC Current Gain: 40@10mA,10V; Transition frequency(fT): 50MHz; Current - Collector Cutoff: 100nA; Vce Saturation(VCE(sat)): 500mV@20mA,2.0mA; Emitter-Base Voltage(Vebo): 6V; Number: 1 NPN
R12 = 0402WGF5603TCE: Type:Thick Film Resistor Resistance:560kΩ Tolerance:±1% Tolerance:±1% Power(Watts):62.5mW Voltage-Supply(Max):50V Temperature Coefficient:±100ppm/℃ Temperature Coefficient:±100ppm/℃ Operating Temperature:-55℃~+155℃ Operating Temperature:-55℃~+155℃; LCSC Part Name: 560kΩ ±1% 62.5mW 厚膜电阻; Supplier Part: C132339; Manufacturer: UNI-ROYAL(厚声); Supplier Footprint: 0402; JLCPCB Part Class: Extended Part; Datasheet: https://item.szlcsc.com/datasheet/0402WGF5603TCE/143638.html; Supplier: LCSC; Type: Thick Film Resistor; Tolerance: ±1%; Power(Watts): 62.5mW; Voltage-Supply(Max): 50V; Temperature Coefficient: ±100ppm/℃; Operating Temperature: -55℃~+155℃
R25 = 0805W8F5102T5E: Type:Thick Film Resistor Resistance:51kΩ Tolerance:±1% Tolerance:±1% Power(Watts):125mW Voltage-Supply(Max):150V Temperature Coefficient:±100ppm/℃ Temperature Coefficient:±100ppm/℃ Operating Temperature:-55℃~+155℃ Operating Temperature:-55℃~+155℃; LCSC Part Name: 51kΩ ±1% 125mW 厚膜电阻; Supplier Part: C17737; Manufacturer: UNI-ROYAL(厚声); Supplier Footprint: 0805; JLCPCB Part Class: Basic Part; Datasheet: https://item.szlcsc.com/datasheet/0805W8F5102T5E/18425.html; Supplier: LCSC; Type: Thick Film Resistor; Tolerance: ±1%; Power(Watts): 125mW; Voltage-Supply(Max): 150V; Temperature Coefficient: ±100ppm/℃; Operating Temperature: -55℃~+155℃
R26 R28 = KTR18EZPJ106: Type:Thick Film Resistor Resistance:10MΩ Tolerance:±5% Tolerance:±5% Power(Watts):250mW Voltage-Supply(Max):500V Temperature Coefficient:±200ppm/℃ Temperature Coefficient:±200ppm/℃ Operating Temperature:-55℃~+155℃ Operating Temperature:-55℃~+155℃; LCSC Part Name: 厚膜电阻 10MΩ ±5% 250mW; Supplier Part: C2092802; Manufacturer: ROHM(罗姆); Supplier Footprint: 1206; JLCPCB Part Class: Extended Part; Datasheet: https://item.szlcsc.com/datasheet/KTR18EZPJ106/2184393.html; Supplier: LCSC; Type: Thick Film Resistor; Tolerance: ±5%; Power(Watts): 250mW; Voltage-Supply(Max): 500V; Temperature Coefficient: ±200ppm/℃; Operating Temperature: -55℃~+155℃
R27 = FRC0402J103 TS: Type:Thick Film Resistor Resistance:10kΩ Tolerance:±5% Tolerance:±5% Power(Watts):62.5mW Voltage-Supply(Max):50V Temperature Coefficient:±100ppm/℃ Temperature Coefficient:±100ppm/℃ Operating Temperature:-55℃~+155℃ Operating Temperature:-55℃~+155℃; LCSC Part Name: 10kΩ ±5% 62.5mW 厚膜电阻; Supplier Part: C2906885; Manufacturer: FOJAN(富捷); Supplier Footprint: 0402; JLCPCB Part Class: Extended Part; Supplier: LCSC; Type: Thick Film Resistor; Tolerance: ±5%; Power(Watts): 62.5mW; Voltage-Supply(Max): 50V; Temperature Coefficient: ±100ppm/℃; Operating Temperature: -55℃~+155℃
R30 = 0402WGF1200TCE: Type:Thick Film Resistor Resistance:120Ω Tolerance:±1% Tolerance:±1% Power(Watts):62.5mW Voltage-Supply(Max):50V Temperature Coefficient:±100ppm/℃ Temperature Coefficient:±100ppm/℃ Operating Temperature:-55℃~+155℃ Operating Temperature:-55℃~+155℃; LCSC Part Name: 120Ω ±1% 62.5mW 厚膜电阻; Supplier Part: C25079; Manufacturer: UNI-ROYAL(厚声); Supplier Footprint: 0402; JLCPCB Part Class: Basic Part; Datasheet: https://item.szlcsc.com/datasheet/0402WGF1200TCE/25822.html; Supplier: LCSC; Type: Thick Film Resistor; Tolerance: ±1%; Power(Watts): 62.5mW; Voltage-Supply(Max): 50V; Temperature Coefficient: ±100ppm/℃; Operating Temperature: -55℃~+155℃
R31 R32 = 0402WGF1003TCE: Type:Thick Film Resistor Resistance:100kΩ Tolerance:±1% Tolerance:±1% Power(Watts):62.5mW Voltage-Supply(Max):50V Temperature Coefficient:±100ppm/℃ Temperature Coefficient:±100ppm/℃ Operating Temperature:-55℃~+155℃ Operating Temperature:-55℃~+155℃; LCSC Part Name: 100kΩ ±1% 62.5mW 厚膜电阻; Supplier Part: C25741; Manufacturer: UNI-ROYAL(厚声); Supplier Footprint: 0402; JLCPCB Part Class: Basic Part; Datasheet: https://item.szlcsc.com/datasheet/0402WGF1003TCE/26484.html; Supplier: LCSC; Type: Thick Film Resistor; Tolerance: ±1%; Power(Watts): 62.5mW; Voltage-Supply(Max): 50V; Temperature Coefficient: ±100ppm/℃; Operating Temperature: -55℃~+155℃
U18 = TLV3201AIDBVR: Number of Channels:1 Vos - Input Offset Voltage:1mV Ib - Input Bias Current:1pA Propagation Delay Time:40ns Input Hysteresis Voltage (Vhys):1mV Common Mode Rejection Ratio(CMRR):- Output Type:- Output Type:CMOS Rail to Rail:Rail-to-Rail Input Quiescent Cu; LCSC Part Name: 40纳秒低功耗推挽输出比较器; Supplier Part: C105188; Manufacturer: TI(德州仪器); Supplier Footprint: SOT-23-5; JLCPCB Part Class: Extended Part; Datasheet: https://www.ti.com/cn/lit/gpn/tlv3201; Supplier: LCSC; Number of Channels: 1; Vos - Input Offset Voltage: 1mV; Ib - Input Bias Current: 1pA; Propagation Delay Time: 40ns; Input Hysteresis Voltage (Vhys): 1mV; Output Type: CMOS; Rail to Rail: Rail-to-Rail Input; Quiescent Current: 40uA; Operating Temperature: -40℃~+125℃
U19 = SBM21

## Nets
3V3: C2.2 C4.2 C5.2 C10.2 C11.1 C12.1 C16.1 C17.1 C18.1 C21.2 C22.1 C23.2 C26.1 C46.1 C68.1 C69.2 C70.1 C71.2 C72.2 C73.1 C74.1 C78.2 C79.2 D1.1 FPC3.1 FPC4.1 FPC5.1 FPC6.1 J_SWD2.1 R12.1 SW1.1 U3.5(VIO) U5.6(V+) U11.5(VDDIO) U11.8(VDD) U11.12(CS) U14.1(VDD) U14.2(PS) U15.3(VDD) U16.5(VIO) U18.5(VCC) U21.4(VBAT) U21.5(VREF+) U21.6(VDD/VDDA) U22.4(VBAT) U22.5(VREF+) U22.6(VDD/VDDA) ; also on sheet 1
+5V: C3.2 C8.1 C9.2 C13.2 C19.1 C20.2 C24.2 C25.1 C27.2 C80.1 FPC3.2 FPC4.2 FPC5.2 FPC6.2 L2.2 L3.1 R4.2 U3.3(VCC) U16.3(VCC) U17.4(EN) U17.5(IN) ; also on sheet 1
+12V: C75.2 C76.2 D2.1(C) D3.1(K) J_PIEZO.1 R22.2
+400V: C14.2 D4.1(K) R26.2 R28.1
GND: C1.2 C2.1 C3.1 C4.1 C5.1 C8.2 C9.1 C10.1 C11.2 C12.2 C13.1 C14.1 C16.2 C17.2 C18.2 C19.2 C20.1 C21.1 C22.2 C23.1 C24.1 C25.2 C26.2 C27.1 C46.2 C68.2 C69.1 C70.2 C71.1 C72.1 C73.2 C74.2 C75.1 C76.1 C78.1 C79.1 C80.2 D1.2 FPC3.3 FPC3.6 FPC3.7 FPC3.8 FPC4.3 FPC4.6 FPC4.7 FPC4.8 FPC5.3 FPC5.6 FPC5.7 FPC5.8 FPC6.3 FPC6.6 FPC6.7 FPC6.8 J_NCTIP.1 J_SWD2.4 LED1.2(K) LED2.2(K) Q1.2(S) Q2.3(E) R4.1 R23.1 R24.1 R25.1 R31.2 R32.1 U3.2(GND) U5.3(V-) U10.2 U10.3 U10.4 U10.5 U11.6(GND) U11.7(GND) U14.3(GND) U14.4(CSB) U14.5(CSB) U15.4(VSS) U15.5(EP) U16.2(GND) U17.2(GND) U18.2(GND) U21.7(VSS/VSSA) U21.49(EP) U22.7(VSS/VSSA) U22.49(EP) X2.2(GND) X3.2(GND) ; also on sheet 1
ACCEL1_INT: U21.14(PA3)
ACCEL2_INT: U11.4(INT1) U21.15(PA4)
BOOT0: R24.2 SW1.4 U21.36(PA14-BOOT0) U22.36(PA14-BOOT0) ; also on sheet 1
CANFD_RX: U3.4(RXD) U16.4(RXD) U21.20(PB1) U22.20(PB1) ; also on sheet 1
CANFD_TX: U3.1(TXD) U16.1(TXD) U21.19(PB0) U22.19(PB0) ; also on sheet 1
CANH: FPC3.5 FPC4.5 FPC5.5 FPC6.5 H1.1 H2.1 U3.7(CANH) U16.7(CANH) ; also on sheet 1
CANL: FPC3.4 FPC4.4 FPC5.4 FPC6.4 R18.1 R30.1 U3.6(CANL) U16.6(CANL) ; also on sheet 1
CHARGEOUT: U5.4(VOUT) U5.8(-IN) U21.11(PA0)
GEIGER_OUT: U18.1(OUT) U22.11(PA0)
HV_MONITOR: R25.2 R26.1 U22.12(PA1)
HV_PWM: R27.2 U22.28(PA8)
I2C_SCL: U11.13(SCL) U14.8(SCLK) U15.2(SCL) U21.45(PB6)
I2C_SDA: U11.14(SDA) U14.7(SDI/SDA) U15.1(SDA) U21.46(PB7)
NCTHERM_ADC: J_NCTIP.2 U21.12(PA1)
OSC_IN: U21.8(PF0-OSC_IN) U22.8(PF0-OSC_IN) X2.1(OSC1) X3.1(OSC1) ; also on sheet 1
OSC_OUT: U21.9(PF1-OSC_OUT) U22.9(PF1-OSC_OUT) X2.3(OSC2) X3.3(OSC2) ; also on sheet 1
PIEZOCTRL: R7.1 U21.28(PA8)
STB: U3.8(STB) U16.8(STB) U21.31(PC7) U22.31(PC7) ; also on sheet 1
SWD_CLK: J_SWD2.3 SW1.3 ; also on sheet 1
SWD_IO: J_SWD2.2 U21.35(PA13) U22.35(PA13) ; also on sheet 1
$1N2784: D4.2(A) L3.2 Q2.1(C)
$1N9534: LED2.1(A) R29.1
$1N9877: R22.1 R23.2 U17.3(FB)
$1N15938: H1.2 R18.2
Net-(C1-1): C1.1 R3.2
Net-(C15-1): C15.1 R32.2 U19.2(Cathode)
Net-(C15-2): C15.2 U18.3(IN+)
Net-(D1-3): D1.3 R1.1 U5.1(+IN)
Net-(D2-2): D2.2(A) J_PIEZO.2 Q1.3(D)
Net-(D3-2): D3.2(A) L2.1 U17.1(SW)
Net-(H2-2): H2.2 R30.2
Net-(LED1-1): LED1.1(A) R5.2
Net-(Q1-1): Q1.1(G) R7.2
Net-(Q2-2): Q2.2(B) R27.1
Net-(R1-2): R1.2 R2.2 R3.1
Net-(R2-1): R2.1 U10.1
Net-(R5-1): R5.1 U21.25(PB13)
Net-(R12-2): R12.2 R31.1 U18.4(IN-)
Net-(R28-2): R28.2 U19.1(Anode)
Net-(R29-2): R29.2 U22.25(PB13)

Not connected (* = marked no-connect by the designer): SW1 2; U5 2(N/C) 5(N/C) 7(N/C); U11 1(SDO/SA0) 2(SDx) 3(SCx) 9(INT2) 10(NC) 11(NC); U14 6(SDO); U17 6(NC); U21 1(PC13) 2(PC14-OSC32_IN) 3(PC15-OSC32_OUT) 10(PF2-NRST) 13(PA2) 16(PA5) 17(PA6) 18(PA7) 21(PB2) 22(PB10) 23(PB11) 24(PB12) 26(PB14) 27(PB15) 29(PA9) 30(PC6) 32(PA10) 33(PA11[PA9]) 34(PA12[PA10]) 37(PA15) 38(PD0) 39(PD1) 40(PD2) 41(PD3) 42(PB3) 43(PB4) 44(PB5) 47(PB8) 48(PB9); U22 1(PC13) 2(PC14-OSC32_IN) 3(PC15-OSC32_OUT) 10(PF2-NRST) 13(PA2) 14(PA3) 15(PA4) 16(PA5) 17(PA6) 18(PA7) 21(PB2) 22(PB10) 23(PB11) 24(PB12) 26(PB14) 27(PB15) 29(PA9) 30(PC6) 32(PA10) 33(PA11[PA9]) 34(PA12[PA10]) 37(PA15) 38(PD0) 39(PD1) 40(PD2) 41(PD3) 42(PB3) 43(PB4) 44(PB5) 45(PB6) 46(PB7) 47(PB8) 48(PB9)

## Notes on the sheets
sheet 2
- MCU
- Barometric Pressure
- Resonance Accelerometer
- Humidity and Temperature
- Nose TIp Temperature Readings
- Piezo Driver
- 12v Power
- CAN FD
- Charge Measurement
- Debug
sheet 3
- MCU
- Geiger Circuit
- CAN FD
- Power Side - Generate 400V
- Detection Side - Measure Pulses
